# Altium schematic sheet BK1096_MIPI_CAM.SchDoc: =project_title
size Tabloid; PageSetup: Record=PageOptions|CenterHorizontal=True|CenterVertical=True|PrintScale=0.73|XCorrection=1.00|YCorrection=1.00|PrintKind=0|BorderSize=5000000|LeftOffset=0|BottomOffset=0|Orientation=2|PaperLength=1000|PaperWidth=1000|Scale=100|PaperSource=7|PrintQuality=-4|MediaType=1|DitherType=10|PaperKind=A4|PrintScaleMode=1; CompanyName: Luxonis Holding; Organization: Luxonis Holding; Address1: 1925 Harmony Park Drive; Address2: Westminster, CO; Address3: 80234; Address4: United States; SheetNumber: 4; SheetTotal: 6
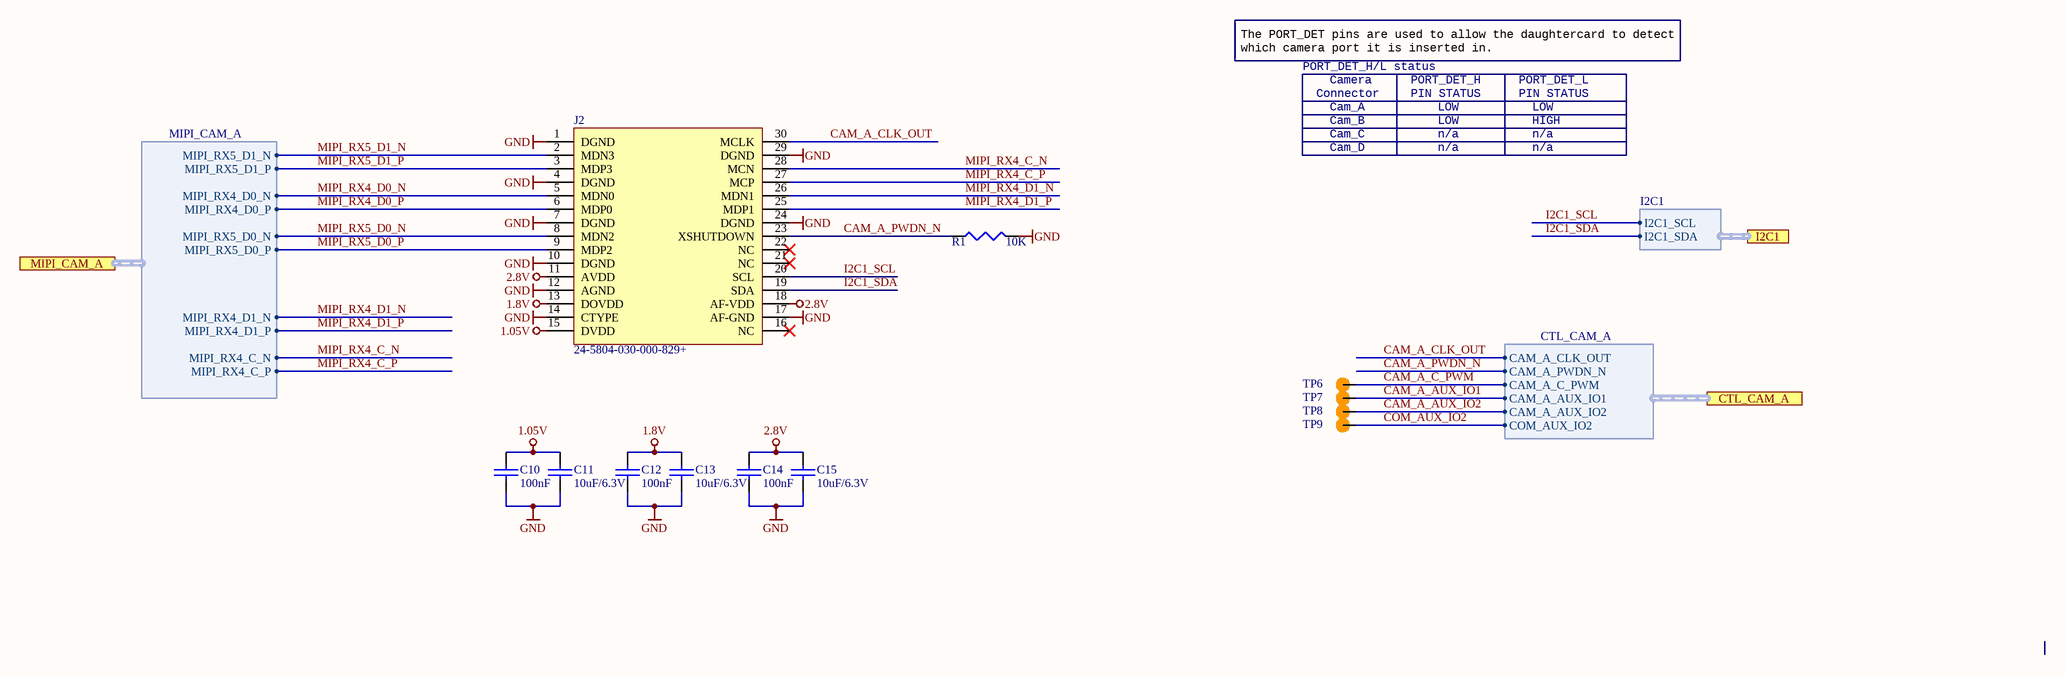
[diagram p0: BK1096_MIPI_CAM.SchDoc]

## Parts
C10  100nF  [CAPC0402(1005)60_N]
C11  10uF/6.3V  [CAPC0603(1608)55_N]
C12  100nF  [CAPC0402(1005)60_N]
C13  10uF/6.3V  [CAPC0603(1608)55_N]
C14  100nF  [CAPC0402(1005)60_N]
C15  10uF/6.3V  [CAPC0603(1608)55_N]
J2  24-5804-030-000-829+  [A12N02A-201_MatedModule]
R1  10K  [RESC0603(1608)_N]
TP6  TP_SMD  [TP_0.75MM_SMD_NO-SILK]  (value not drawn)  (no BOM)
TP7  TP_SMD  [TP_0.75MM_SMD_NO-SILK]  (value not drawn)  (no BOM)
TP8  TP_SMD  [TP_0.75MM_SMD_NO-SILK]  (value not drawn)  (no BOM)
TP9  TP_SMD  [TP_0.75MM_SMD_NO-SILK]  (value not drawn)  (no BOM)

## Ports
CTL_CAM_A (harness CTL_CAM_A), I2C1 (harness I2C1), MIPI_CAM_A (harness MIPI_CAM_A)

## Harnesses
I2C1: I2C1_SDA, I2C1_SCL
MIPI_CAM_A: MIPI_RX4_D0_P, MIPI_RX4_D0_N, MIPI_RX4_D1_P, MIPI_RX4_D1_N, MIPI_RX4_C_N, MIPI_RX4_C_P, MIPI_RX5_D1_P, MIPI_RX5_D1_N, MIPI_RX5_D0_P, MIPI_RX5_D0_N
CTL_CAM_A: CAM_A_C_PWM, CAM_A_AUX_IO1, CAM_A_AUX_IO2, COM_AUX_IO2, CAM_A_PWDN_N, CAM_A_CLK_OUT

## Nets
1.05V: C10.2 C11.2 J2.15(DVDD)
1.8V: C12.2 C13.2 J2.13(DOVDD)
2.8V: C14.2 C15.2 J2.11(AVDD) J2.18(AF-VDD)
GND: C10.1 C11.1 C12.1 C13.1 C14.1 C15.1 J2.1(DGND) J2.4(DGND) J2.7(DGND) J2.10(DGND) J2.12(AGND) J2.14(CTYPE) J2.17(AF-GND) J2.24(DGND) J2.29(DGND) R1.2
CAM_A_AUX_IO1: TP7.1 ; port CTL_CAM_A.CAM_A_AUX_IO1
CAM_A_AUX_IO2: TP8.1 ; port CTL_CAM_A.CAM_A_AUX_IO2
CAM_A_C_PWM: TP6.1 ; port CTL_CAM_A.CAM_A_C_PWM
CAM_A_CLK_OUT: J2.30(MCLK) ; port CTL_CAM_A.CAM_A_CLK_OUT
CAM_A_PWDN_N: J2.23(XSHUTDOWN) R1.1 ; port CTL_CAM_A.CAM_A_PWDN_N
COM_AUX_IO2: TP9.1 ; port CTL_CAM_A.COM_AUX_IO2
I2C1_SCL: J2.20(SCL) ; port I2C1.I2C1_SCL
I2C1_SDA: J2.19(SDA) ; port I2C1.I2C1_SDA
MIPI_RX4_C_N: J2.28(MCN) ; port MIPI_CAM_A.MIPI_RX4_C_N
MIPI_RX4_C_P: J2.27(MCP) ; port MIPI_CAM_A.MIPI_RX4_C_P
MIPI_RX4_D0_N: J2.5(MDN0) ; port MIPI_CAM_A.MIPI_RX4_D0_N
MIPI_RX4_D0_P: J2.6(MDP0) ; port MIPI_CAM_A.MIPI_RX4_D0_P
MIPI_RX4_D1_N: J2.26(MDN1) ; port MIPI_CAM_A.MIPI_RX4_D1_N
MIPI_RX4_D1_P: J2.25(MDP1) ; port MIPI_CAM_A.MIPI_RX4_D1_P
MIPI_RX5_D0_N: J2.8(MDN2) ; port MIPI_CAM_A.MIPI_RX5_D0_N
MIPI_RX5_D0_P: J2.9(MDP2) ; port MIPI_CAM_A.MIPI_RX5_D0_P
MIPI_RX5_D1_N: J2.2(MDN3) ; port MIPI_CAM_A.MIPI_RX5_D1_N
MIPI_RX5_D1_P: J2.3(MDP3) ; port MIPI_CAM_A.MIPI_RX5_D1_P

Not connected (* = marked no-connect by the designer): J2 16(NC)* 21(NC)* 22(NC)*

## Notes on the sheet
- The PORT_DET pins are used to allow the daughtercard to detect which camera port it is inserted in.
- PORT_DET_H/L status
- Connector
- Camera
- PORT_DET_H
- PIN STATUS
- PORT_DET_L
- Cam_A
- Cam_B
- Cam_C
- Cam_D
- LOW
- n/a
- HIGH
- Title
- Size:
- Date:
- Tabloid
- Number:
- Time:
- Revision:
- Sheet
- of
- Drawn by:

## Library data of the parts
C10 C12 C14 = CAP: SMD Multilayer Ceramic Capacitor, 0402 [1005 Metric], 0.1 µF, 10 V, ± 10%, X5R; MAN: Kemet; MAN PN: C0402C104K8PACTU; ICCO PN: MV122005; DIST: Farnell; DIST PN: 2392235
C11 C13 C15 = CAP: SMD Multilayer Ceramic Capacitor, 0603 [1608 Metric], 10 µF, 6.3 V, ± 20%, X5R; MAN: Yageo(PHYCOM); MAN PN: CC0603MRX5R5BB106; ICCO PN: MV122009; DIST: Farnell; DIST PN: 1458902
J2 = A12N02A-201: Series 5804 board to board 0.4mm pitch 30 way connector; MAN: AVX/KYOCERA; MAN PN: 24-5804-030-000-829+
R1 = RES1: SMD Chip Resistor, 10 kohm, 75 V, 0603 [1608 Metric], 100 mW, ± 1%; MAN: WALSIN; MAN PN: WR06X1002FTL; ICCO PN: MV122008; DIST: Farnell; DIST PN: 2502397
TP6-TP9 = TP_SMD: circular pad test point, SMD